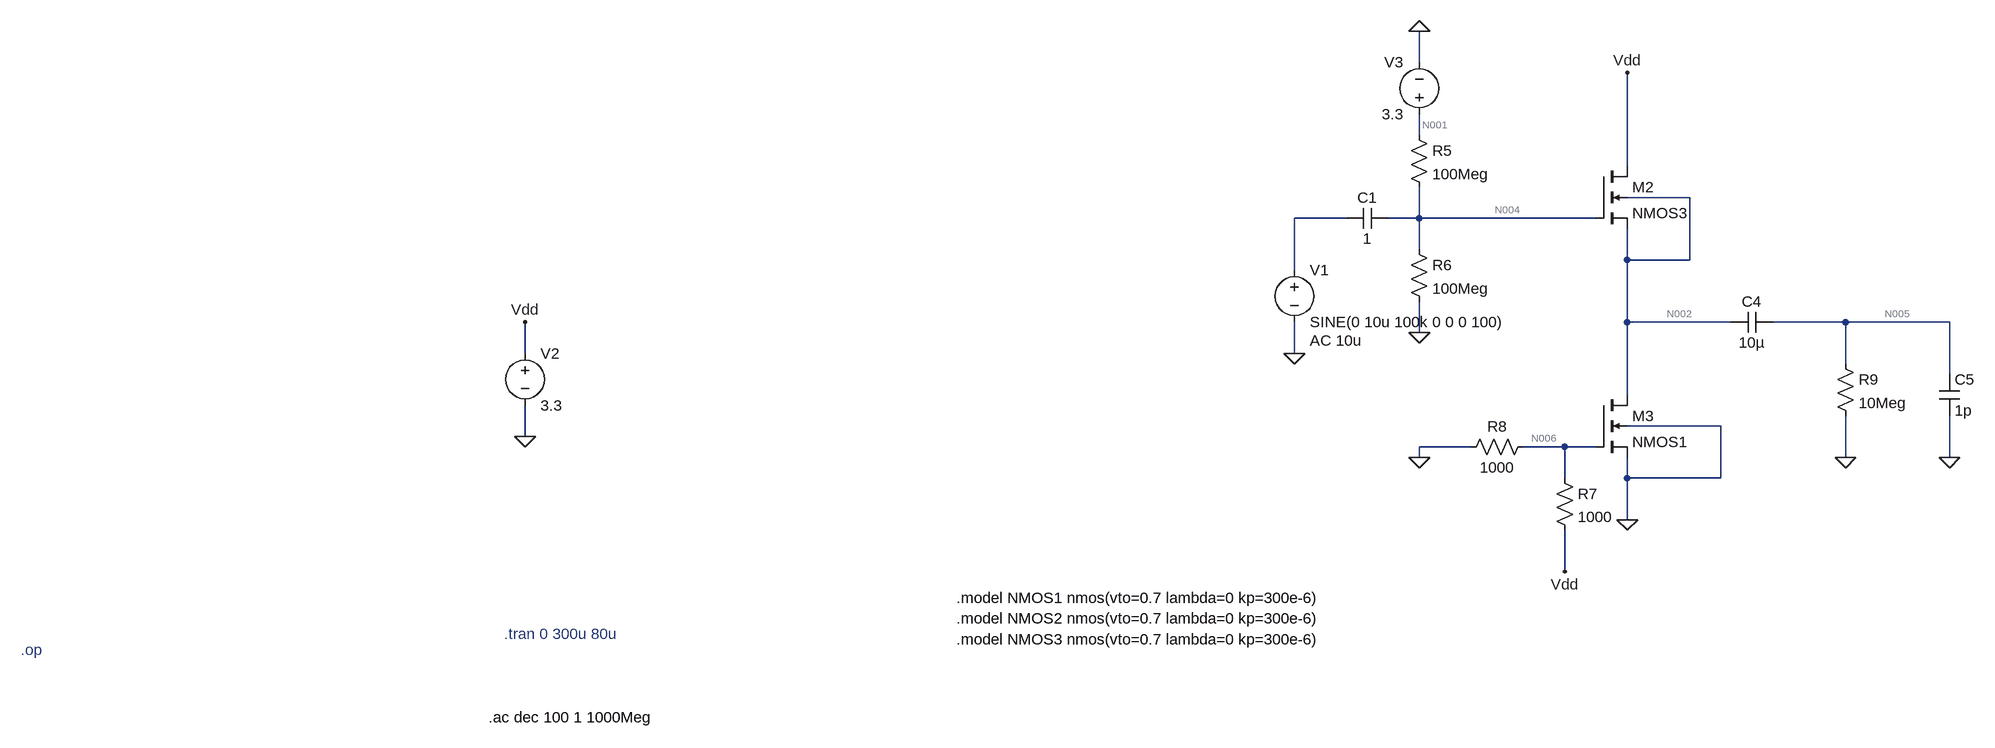
[diagram p0: schematic 1f.asc]
1f.asc, the LTspice schematic file:
Version 4.1
SHEET 1 2104 680
WIRE 1248 -544 1248 -592
WIRE 1248 -432 1248 -464
WIRE 1568 -384 1568 -528
WIRE 1664 -336 1568 -336
WIRE 1136 -304 1056 -304
WIRE 1248 -304 1248 -352
WIRE 1248 -304 1200 -304
WIRE 1520 -304 1248 -304
WIRE 1248 -256 1248 -304
WIRE 1568 -240 1568 -288
WIRE 1664 -240 1664 -336
WIRE 1664 -240 1568 -240
WIRE 1056 -224 1056 -304
WIRE 1568 -144 1568 -240
WIRE 1728 -144 1568 -144
WIRE 1904 -144 1792 -144
WIRE 2064 -144 1904 -144
WIRE 1248 -128 1248 -176
WIRE -128 -96 -128 -144
WIRE 1056 -96 1056 -144
WIRE 1904 -80 1904 -144
WIRE 2064 -64 2064 -144
WIRE 1568 -32 1568 -144
WIRE 1712 16 1568 16
WIRE -128 32 -128 -16
WIRE 1328 48 1248 48
WIRE 1472 48 1408 48
WIRE 1520 48 1472 48
WIRE 1248 64 1248 48
WIRE 1904 64 1904 0
WIRE 2064 64 2064 0
WIRE 1472 96 1472 48
WIRE 1568 96 1568 64
WIRE 1712 96 1712 16
WIRE 1712 96 1568 96
WIRE 1568 160 1568 96
WIRE 1472 240 1472 176
FLAG -128 -144 Vdd
FLAG -128 32 0
FLAG 1056 -96 0
FLAG 1248 -128 0
FLAG 1568 160 0
FLAG 1568 -528 Vdd
FLAG 1472 240 Vdd
FLAG 1248 64 0
FLAG 1904 64 0
FLAG 1248 -592 0
FLAG 2064 64 0
SYMBOL voltage 1056 -240 R0
WINDOW 123 24 124 Left 2
WINDOW 39 0 0 Left 0
SYMATTR Value2 AC 10u
SYMATTR InstName V1
SYMATTR Value SINE(0 10u 100k 0 0 0 100)
SYMBOL voltage -128 -112 R0
SYMATTR InstName V2
SYMATTR Value 3.3
SYMBOL cap 1200 -320 R90
WINDOW 0 0 32 VBottom 2
WINDOW 3 32 32 VTop 2
SYMATTR InstName C1
SYMATTR Value 1
SYMBOL res 1232 -272 R0
SYMATTR InstName R6
SYMATTR Value 100Meg
SYMBOL nmos4 1520 -384 R0
SYMATTR InstName M2
SYMATTR Value NMOS3
SYMATTR Value2 l=1 w=23
SYMBOL nmos4 1520 -32 R0
SYMATTR InstName M3
SYMATTR Value NMOS1
SYMBOL res 1456 80 R0
SYMATTR InstName R7
SYMATTR Value 1000
SYMBOL res 1424 32 R90
WINDOW 0 0 56 VBottom 2
WINDOW 3 32 56 VTop 2
SYMATTR InstName R8
SYMATTR Value 1000
SYMBOL res 1888 -96 R0
SYMATTR InstName R9
SYMATTR Value 10Meg
SYMBOL cap 1792 -160 R90
WINDOW 0 0 32 VBottom 2
WINDOW 3 32 32 VTop 2
SYMATTR InstName C4
SYMATTR Value 10µ
SYMBOL voltage 1248 -448 R180
WINDOW 0 24 96 Left 2
WINDOW 3 24 16 Left 2
SYMATTR InstName V3
SYMATTR Value 3.3
SYMBOL res 1232 -448 R0
SYMATTR InstName R5
SYMATTR Value 100Meg
SYMBOL cap 2048 -64 R0
SYMATTR InstName C5
SYMATTR Value 1p
TEXT 536 312 Left 2 !.model NMOS2 nmos(vto=0.7 lambda=0 kp=300e-6)
TEXT -160 336 Left 2 ;.tran 0 300u 80u
TEXT -904 360 Left 2 ;.op
TEXT -184 464 Left 2 !.ac dec 100 1 1000Meg
TEXT 536 280 Left 2 !.model NMOS1 nmos(vto=0.7 lambda=0 kp=300e-6)
TEXT 536 344 Left 2 !.model NMOS3 nmos(vto=0.7 lambda=0 kp=300e-6)

The netlist it stands for:
* 1f.asc
V1 N003 0 SINE(0 10u 100k 0 0 0 100) AC 10u
V2 Vdd 0 3.3
C1 N004 N003 1
R6 N004 0 100Meg
M2 Vdd N004 N002 N002 NMOS3 l=1 w=23
M3 N002 N006 0 0 NMOS1
R7 N006 Vdd 1000
R8 N006 0 1000
R9 N005 0 10Meg
C4 N005 N002 10µ
V3 N001 0 3.3
R5 N001 N004 100Meg
C5 N005 0 1p
.model NMOS NMOS
.model PMOS PMOS
.lib standard.mos
.model NMOS2 nmos(vto=0.7 lambda=0 kp=300e-6)
* .tran 0 300u 80u
* .op
.ac dec 100 1 1000Meg
.model NMOS1 nmos(vto=0.7 lambda=0 kp=300e-6)
.model NMOS3 nmos(vto=0.7 lambda=0 kp=300e-6)
.backanno
.end

* Results of the author's LTspice run, read from the files saved beside the schematic
* Operating Point, zero values left out:
*   V(vdd) = 3.3 V
*   V(n002) = 756 mV
*   V(n006) = 1.65 V
*   V(n001) = 3.3 V
*   V(n004) = 1.65 V
*   I(V1) = 1.65 pA
*   I(R8) = 1.65 mA
*   I(C1) = 1.65 pA
*   Id(M2) = 129.7 µA
*   Is(M2) = -129.7 µA
*   Ib(M2) = -2.554 pA
*   Id(M3) = 129.7 µA
*   Is(M3) = -129.7 µA
*   I(V3) = -16.5 nA
*   I(R6) = 16.5 nA
*   I(R7) = -1.65 mA
*   I(R5) = 16.5 nA
*   I(V2) = -1.78 mA
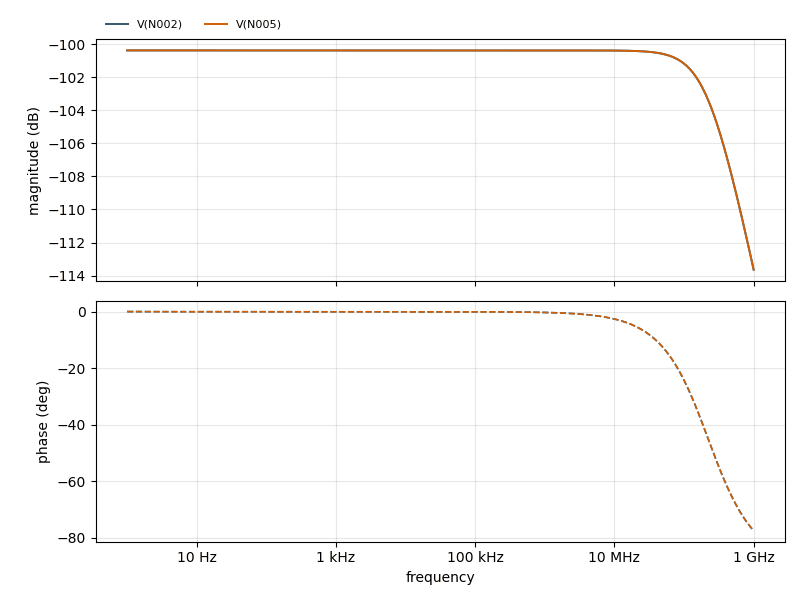
[diagram p1: AC Analysis of 1f.asc, plotted from the saved traces]
* AC Analysis, 1 run:
*   V(N002): -100.37 dB at 1 Hz, -113.64 dB at 1 GHz, peak -100.37 dB at 1 Hz, 3 dB below the peak at 222.2 MHz
*   V(N005): -100.37 dB at 1 Hz, -113.64 dB at 1 GHz, peak -100.37 dB at 588.8 Hz, 3 dB below the peak at 222.2 MHz